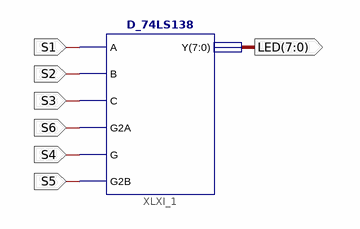
[diagram p0: schematic sheet 1]
// Xilinx ISE schematic D_74LS138_Test.sch (kintex7) as structural Verilog: 1 symbols, 7 ports
module D_74LS138_Test (
  input  S1,
  input  S2,
  input  S3,
  input  S6,
  input  S4,
  input  S5,
  output [7:0] LED
);

  D_74LS138 XLXI_1 (.A(S1), .B(S2), .C(S3), .G2A(S6), .G(S4), .G2B(S5), .Y(LED));
endmodule
